# EAGLE design battery_monitor (EAGLE 7.2.0)
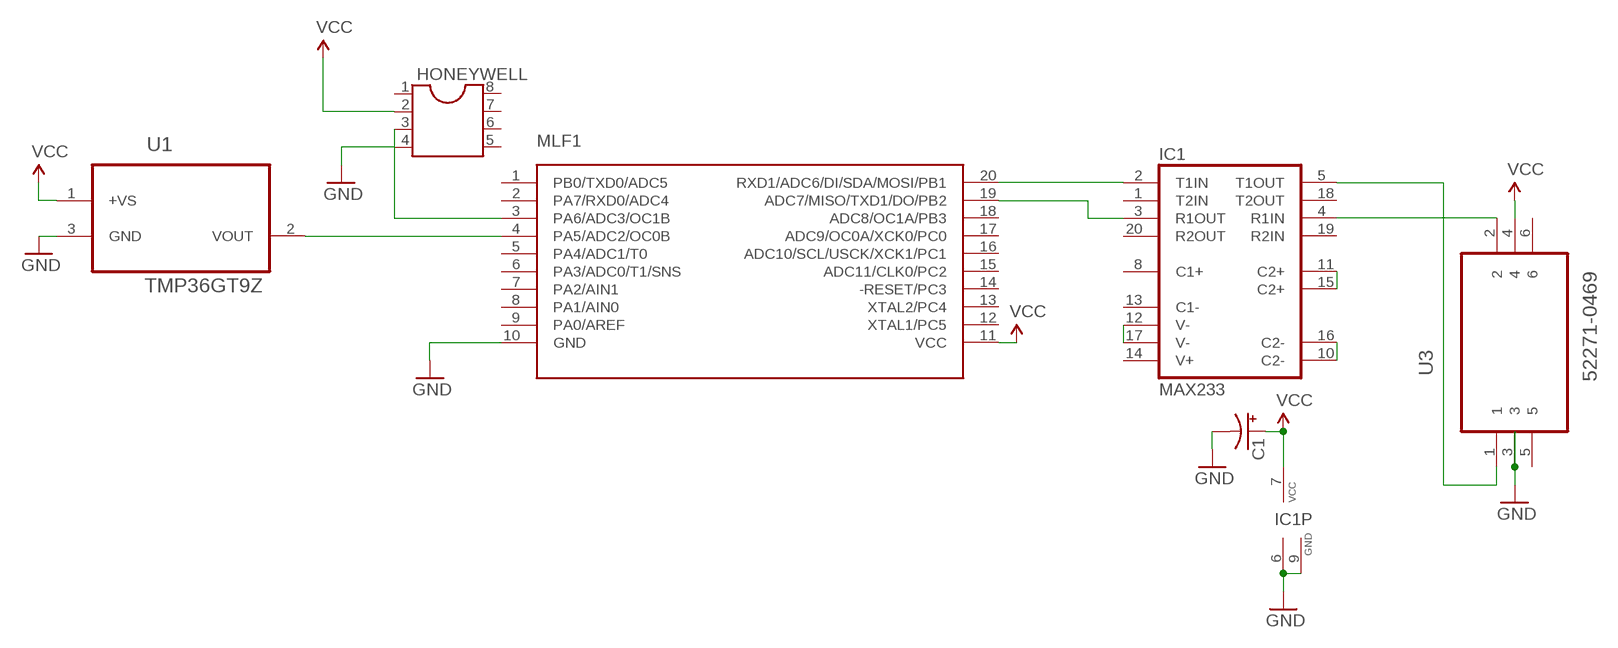
[diagram p0: schematic, sheet 1]

## Parts
C1  CAP_POLPTH1  [CPOL-RADIAL-100UF-25V]
HONEYWELL  DIL8S  [SOCKET-08]
IC1  MAX233  [DIL20]
MLF1  ATTINY1634SOIC20  [SOIC20]
U1  TMP36GT9Z  [TO127P254X533-3P]
U3  52271-0469  [MOLEX_52271-0469]

## Nets
GND: C1.2(-) HONEYWELL.4 IC1.6(GND) IC1.9(GND) MLF1.10(GND) U1.3(GND) U3.3
N$1: MLF1.4(PA5/ADC2/OC0B) U1.2(VOUT)
N$2: IC1.12(V-) IC1.17(V-)
N$3: IC1.11(C2+) IC1.15(C2+)
N$4: IC1.10(C2-) IC1.16(C2-)
N$6: HONEYWELL.3 MLF1.3(PA6/ADC3/OC1B)
N$7: IC1.3(R1OUT) MLF1.19(ADC7/MISO/TXD1/DO/PB2)
N$8: IC1.2(T1IN) MLF1.20(RXD1/ADC6/DI/SDA/MOSI/PB1)
N$9: IC1.4(R1IN) U3.2
N$10: IC1.5(T1OUT) U3.1
VCC: C1.1(+) HONEYWELL.2 IC1.7(VCC) MLF1.11(VCC) U1.1(+VS) U3.4
Unconnected: HONEYWELL.1 HONEYWELL.5 HONEYWELL.6 HONEYWELL.7 HONEYWELL.8 IC1.1(T2IN) IC1.8(C1+) IC1.13(C1-) IC1.14(V+) IC1.18(T2OUT) IC1.19(R2IN) IC1.20(R2OUT) MLF1.1(PB0/TXD0/ADC5) MLF1.2(PA7/RXD0/ADC4) MLF1.5(PA4/ADC1/T0) MLF1.6(PA3/ADC0/T1/SNS) MLF1.7(PA2/AIN1) MLF1.8(PA1/AIN0) MLF1.9(PA0/AREF) MLF1.12(XTAL1/PC5) MLF1.13(XTAL2/PC4) MLF1.14(-RESET/PC3) MLF1.15(ADC11/CLK0/PC2) MLF1.16(ADC10/SCL/USCK/XCK1/PC1) MLF1.17(ADC9/OC0A/XCK0/PC0) MLF1.18(ADC8/OC1A/PB3) U3.5 U3.6

## Library data of the parts
C1 = SparkFun-Capacitors:CAP_POL: Capacitor Polarized These are standard SMD and PTH capacitors. Normally 10uF, 47uF, and 100uF in electrolytic and tantalum varieties. Always verify the external diameter of the through hole cap, it varies with capacity, voltage, and manufacturer. The EIA devices should be standard.
HONEYWELL = ic-package:DIL8: Dual In Line / Socket
IC1 = maxim:MAX233: RS232 TRANSCEIVER; MPN: MAX233ACPP+G36; OC_FARNELL: 1593332; OC_NEWARK: 89K3459
MLF1 = attiny1634:ATTINY1634
U1 = ADI-Phase-2:TMP36GT9Z: Voltage Output Temperature Sensors; MPN: TMP36GT9Z; OC_FARNELL: 1438760; OC_NEWARK: 19M9015; PACKAGE: TO-92; SUPPLIER: Analog Devices
U3 = Molex_By_element14_Batch_1:52271-0469: CONNECTOR, FPC, 1.0MM, 4 WAY; MPN: 52271-0469; OC_FARNELL: 1757086; OC_NEWARK: 07P8558; PACKAGE: CONNECTOR, FPC, 1.0MM, 4 WAY; SUPPLIER: Molex

## Board
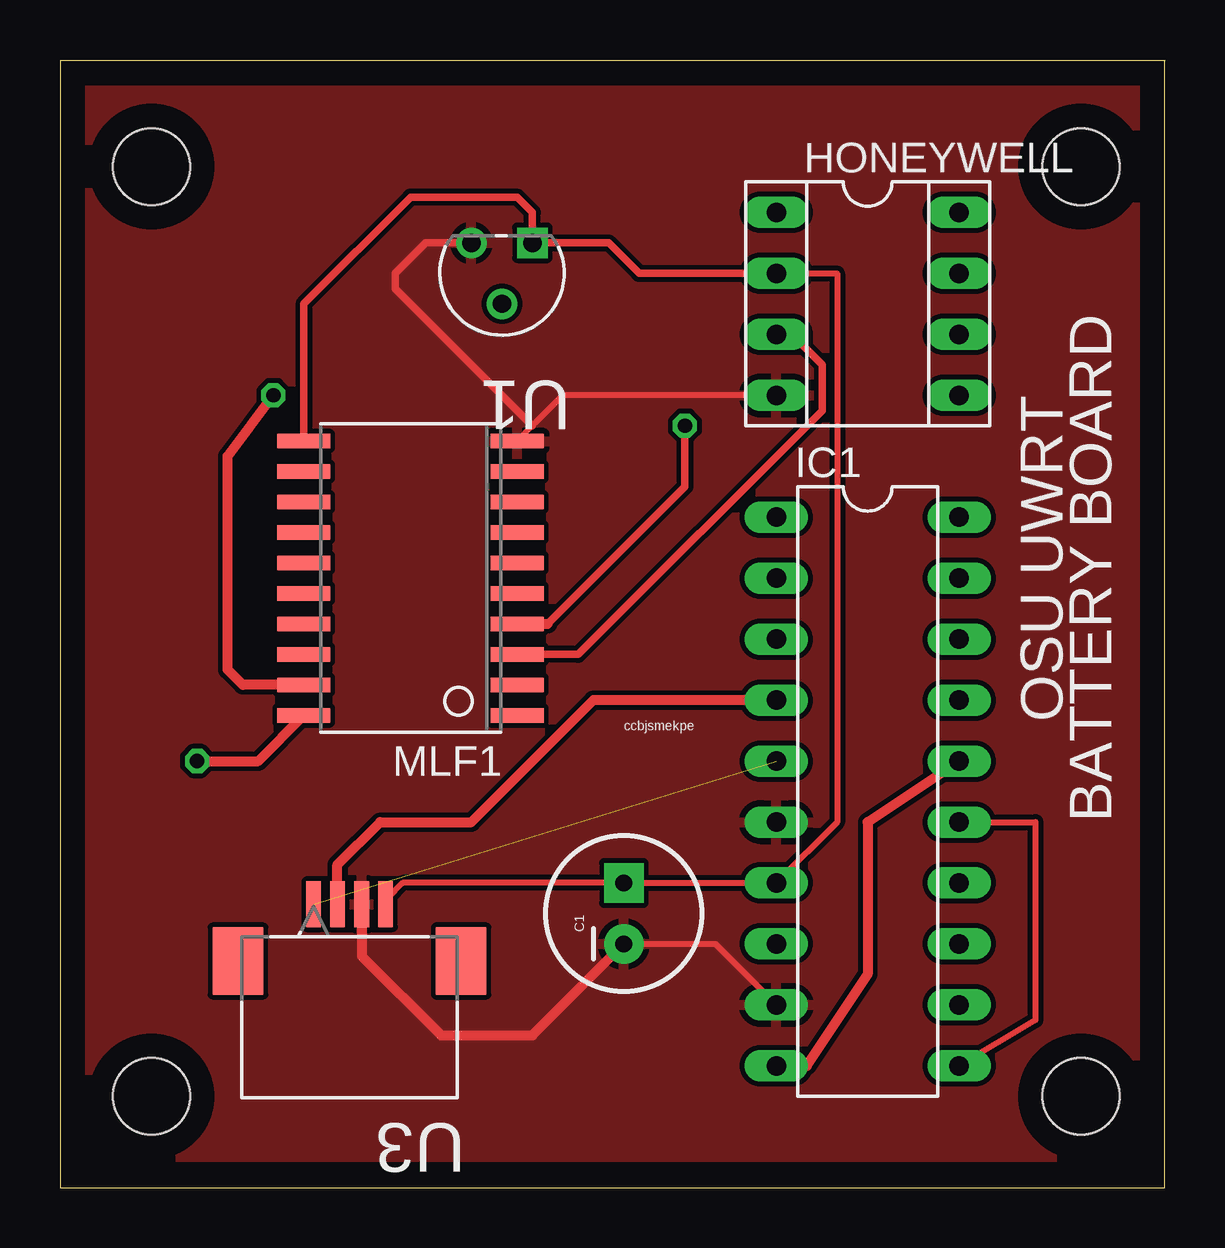
[diagram p1: board, top side]
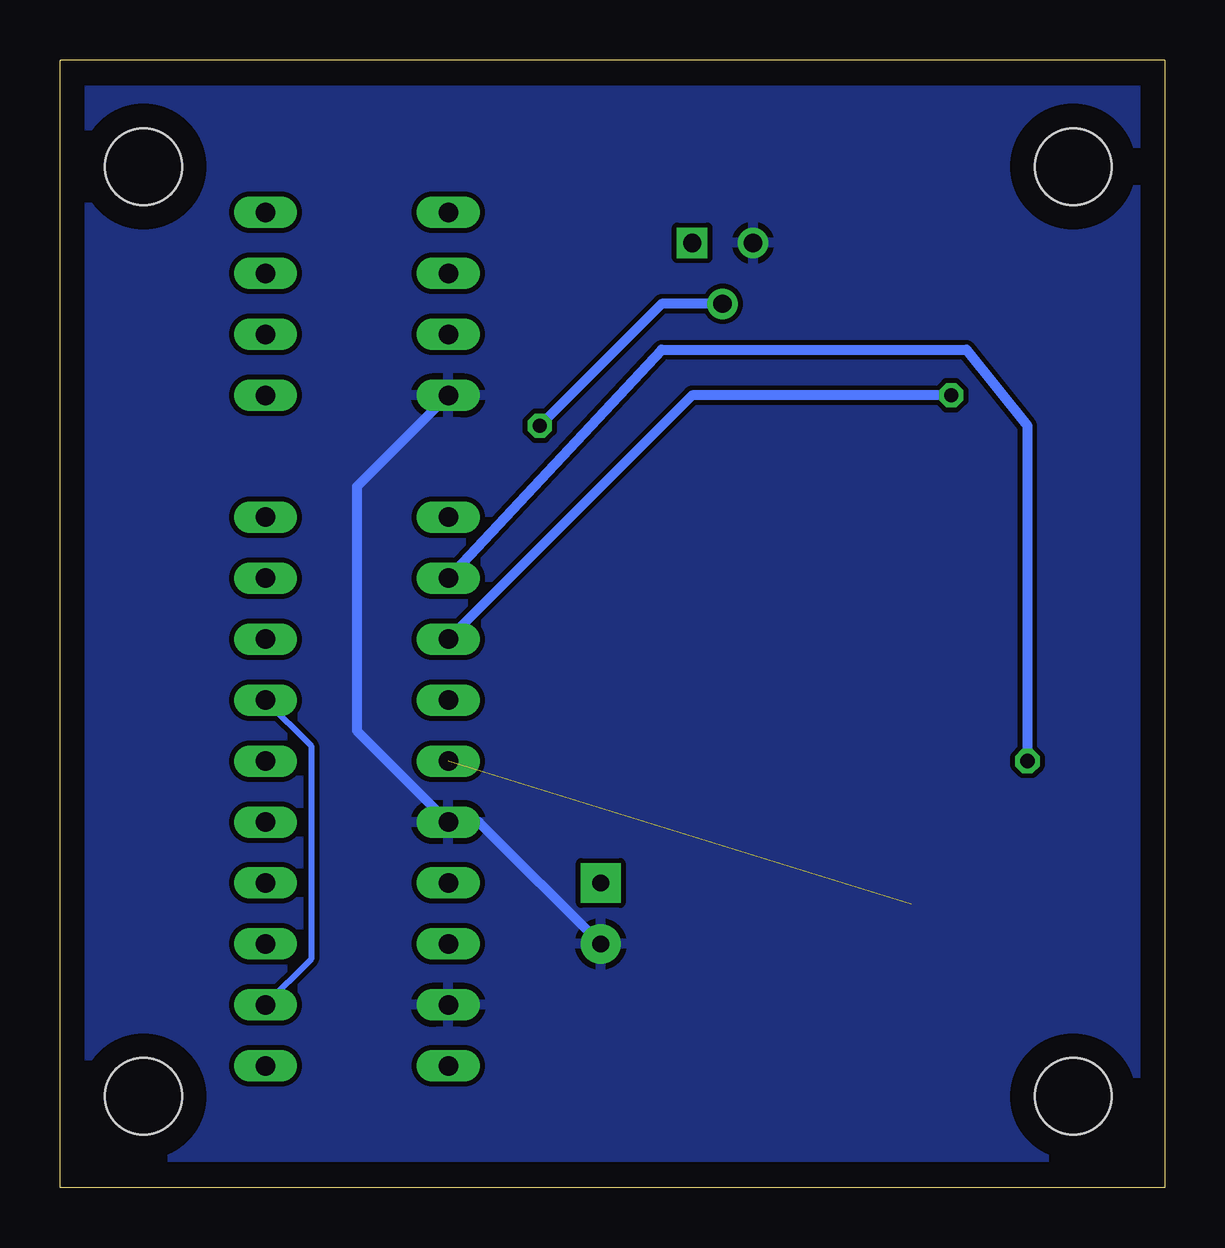
[diagram p2: board, bottom side, seen from below]

Size 46.02 x 46.99 mm. Coordinates in mm from the lower left corner, seen from the top.
Outline: 46.02,46.98 46.02,0 0,0 0,46.99 46.02,46.99 46.02,46.97
Copper layers (1*16): Top 0.035mm / dielectric 1.5mm / Bottom 0.035mm
Design rules "default": minimum track width 10mil, minimum drill 24mil, track to track 8mil, track to pad 8mil, pad to pad 8mil, via to via 8mil, smd to smd 8mil, copper to edge 40mil, drill to drill 8mil, minimum pad ring 10mil, minimum via ring 8mil, stop-mask expansion 4mil, vias tented up to drill 0mil, thermal gap 10mil
Holes 3.2 mm at 42.55,3.81 3.81,3.81 3.81,42.55 42.55,42.55

### Footprints (pad centres in the part's own frame; a part is rotated, then mirrored left to right if it is on the bottom)
CPOL-RADIAL-100UF-25V = drill 0.7 pad 1.651 square: 1 1.27,0 | drill 0.7 pad 1.651: 2 -1.27,0
SOCKET-08 = drill 0.813 long: 1 -3.81,-3.81; 2 -1.27,-3.81; 3 1.27,-3.81; 4 3.81,-3.81; 5 3.81,3.81; 6 1.27,3.81; 7 -1.27,3.81; 8 -3.81,3.81
DIL20 = drill 0.813 long: 1 -11.43,-3.81; 2 -8.89,-3.81; 3 -6.35,-3.81; 4 -3.81,-3.81; 5 -1.27,-3.81; 6 1.27,-3.81; 7 3.81,-3.81; 8 6.35,-3.81; 9 8.89,-3.81; 10 11.43,-3.81; 11 11.43,3.81; 12 8.89,3.81; 13 6.35,3.81; 14 3.81,3.81; 15 1.27,3.81; 16 -1.27,3.81; 17 -3.81,3.81; 18 -6.35,3.81; 19 -8.89,3.81; 20 -11.43,3.81
SOIC20 = smd 0.6 x 2.2: 1 -1.905,-4.445; 2 -0.635,-4.445; 3 0.635,-4.445; 4 1.905,-4.445; 5 3.175,-4.445; 6 4.445,-4.445; 7 5.715,-4.445; 8 6.985,-4.445; 9 8.255,-4.445; 10 9.525,-4.445; 11 9.525,4.445; 12 8.255,4.445; 13 6.985,4.445; 14 5.715,4.445; 15 4.445,4.445; 16 3.175,4.445; 17 1.905,4.445; 18 0.635,4.445; 19 -0.635,4.445; 20 -1.905,4.445
TO127P254X533-3P = drill 0.762 square: 1 -2.54,-2.54 | drill 0.762: 2 -1.27,0; 3 0,-2.54
MOLEX_52271-0469 = smd 0.61 x 1.905: 1 1.499,4.699; 2 0.508,4.699; 3 -0.508,4.699; 4 -1.499,4.699 | smd 2.108 x 2.794: 5 -4.648,7.061; 6 4.648,7.061

### Placement (x,y rotation side)
C1  23.49,11.43 90 top
HONEYWELL  33.66,36.83 270 top
IC1  33.66,16.51 270 top
MLF1  14.61,21.59 90 top
U1  17.14,36.83 180 top
U3  12.06,16.51 180 top

### Tracks (layer width: path | path; a pad name or v marks a point on that pad's centre or on a via)
GND
  Top 0.254: MLF1.10 19.68,31.75 20.95,33.02 HONEYWELL.4 | IC1.9 27.3,10.16 C1.2
  Top 0.305: U1.3 15.24,39.37 13.97,38.1 13.97,37.47 19.68,31.75
  Top 0.406: U3.3 12.57,9.65 15.88,6.35 19.68,6.35 C1.2
  Bottom 0.406: C1.2 28.57,15.24 IC1.6 33.66,19.05 33.66,29.21 HONEYWELL.4
  pour Top: 0.64,45.72 45.09,45.72 45.09,1.27 0.64,1.27
  pour Bottom: 0.64,45.72 0.64,1.27 45.09,1.27 45.09,45.72
N$1  (via drill 0.6)
  Top 0.305: v26.04,31.75 26.04,29.21 20.32,23.5
  Top 0.406: MLF1.4 20.32,23.5
  Bottom 0.406: U1.2 20.95,36.83 v26.04,31.75
N$2
  Bottom 0.254: IC1.12 35.56,9.52 35.56,18.41 IC1.17
N$3
  Top 0.254: IC1.11 40.64,6.99 40.64,15.24 IC1.15
N$4
  Top 0.406: IC1.10 31.11,5.08 33.66,8.89 33.66,15.24 IC1.16
N$6
  Top 0.305: HONEYWELL.3 30.48,35.56 31.75,34.29 31.75,32.38 21.59,22.23 MLF1.3
N$7  (via drill 0.6)
  Top 0.406: MLF1.19 7.62,20.96 6.99,21.59 6.99,30.48 v8.89,33.02
  Bottom 0.406: v8.89,33.02 19.68,33.02 IC1.3
N$8  (via drill 0.6)
  Top 0.406: v5.71,17.78 8.26,17.78 MLF1.20
  Bottom 0.406: IC1.2 20.95,34.93 8.26,34.93 5.71,31.75 v5.71,17.78
N$9
  Top 0.406: IC1.4 22.22,20.32 17.14,15.24 13.34,15.24 11.56,13.46 U3.2
N$10  (1 unrouted)
VCC
  Top 0.254: U3.4 13.65,12.07 14.29,12.7 C1.1 IC1.7 32.39,15.24 32.39,38.1 HONEYWELL.2
  Top 0.305: HONEYWELL.2 24.13,38.1 22.86,39.37 U1.1 19.68,40.64 19.05,41.27 14.61,41.27 10.16,36.83 MLF1.11

### Text on the board
tPlace: OSU UWRT | ccbjsmekpe | BATTERY BOARD